# EAGLE design dots (EAGLE 6.1)
APVD: B.F (15-01-03); DOC_ID: CLK-SCH-06; DOC_PART_NO: CLK-PC-06; DOC_REV: A; DOC_TITLE: Display (model B) - Dots; PROJECT_NAME: Alarm Clock (Model B)
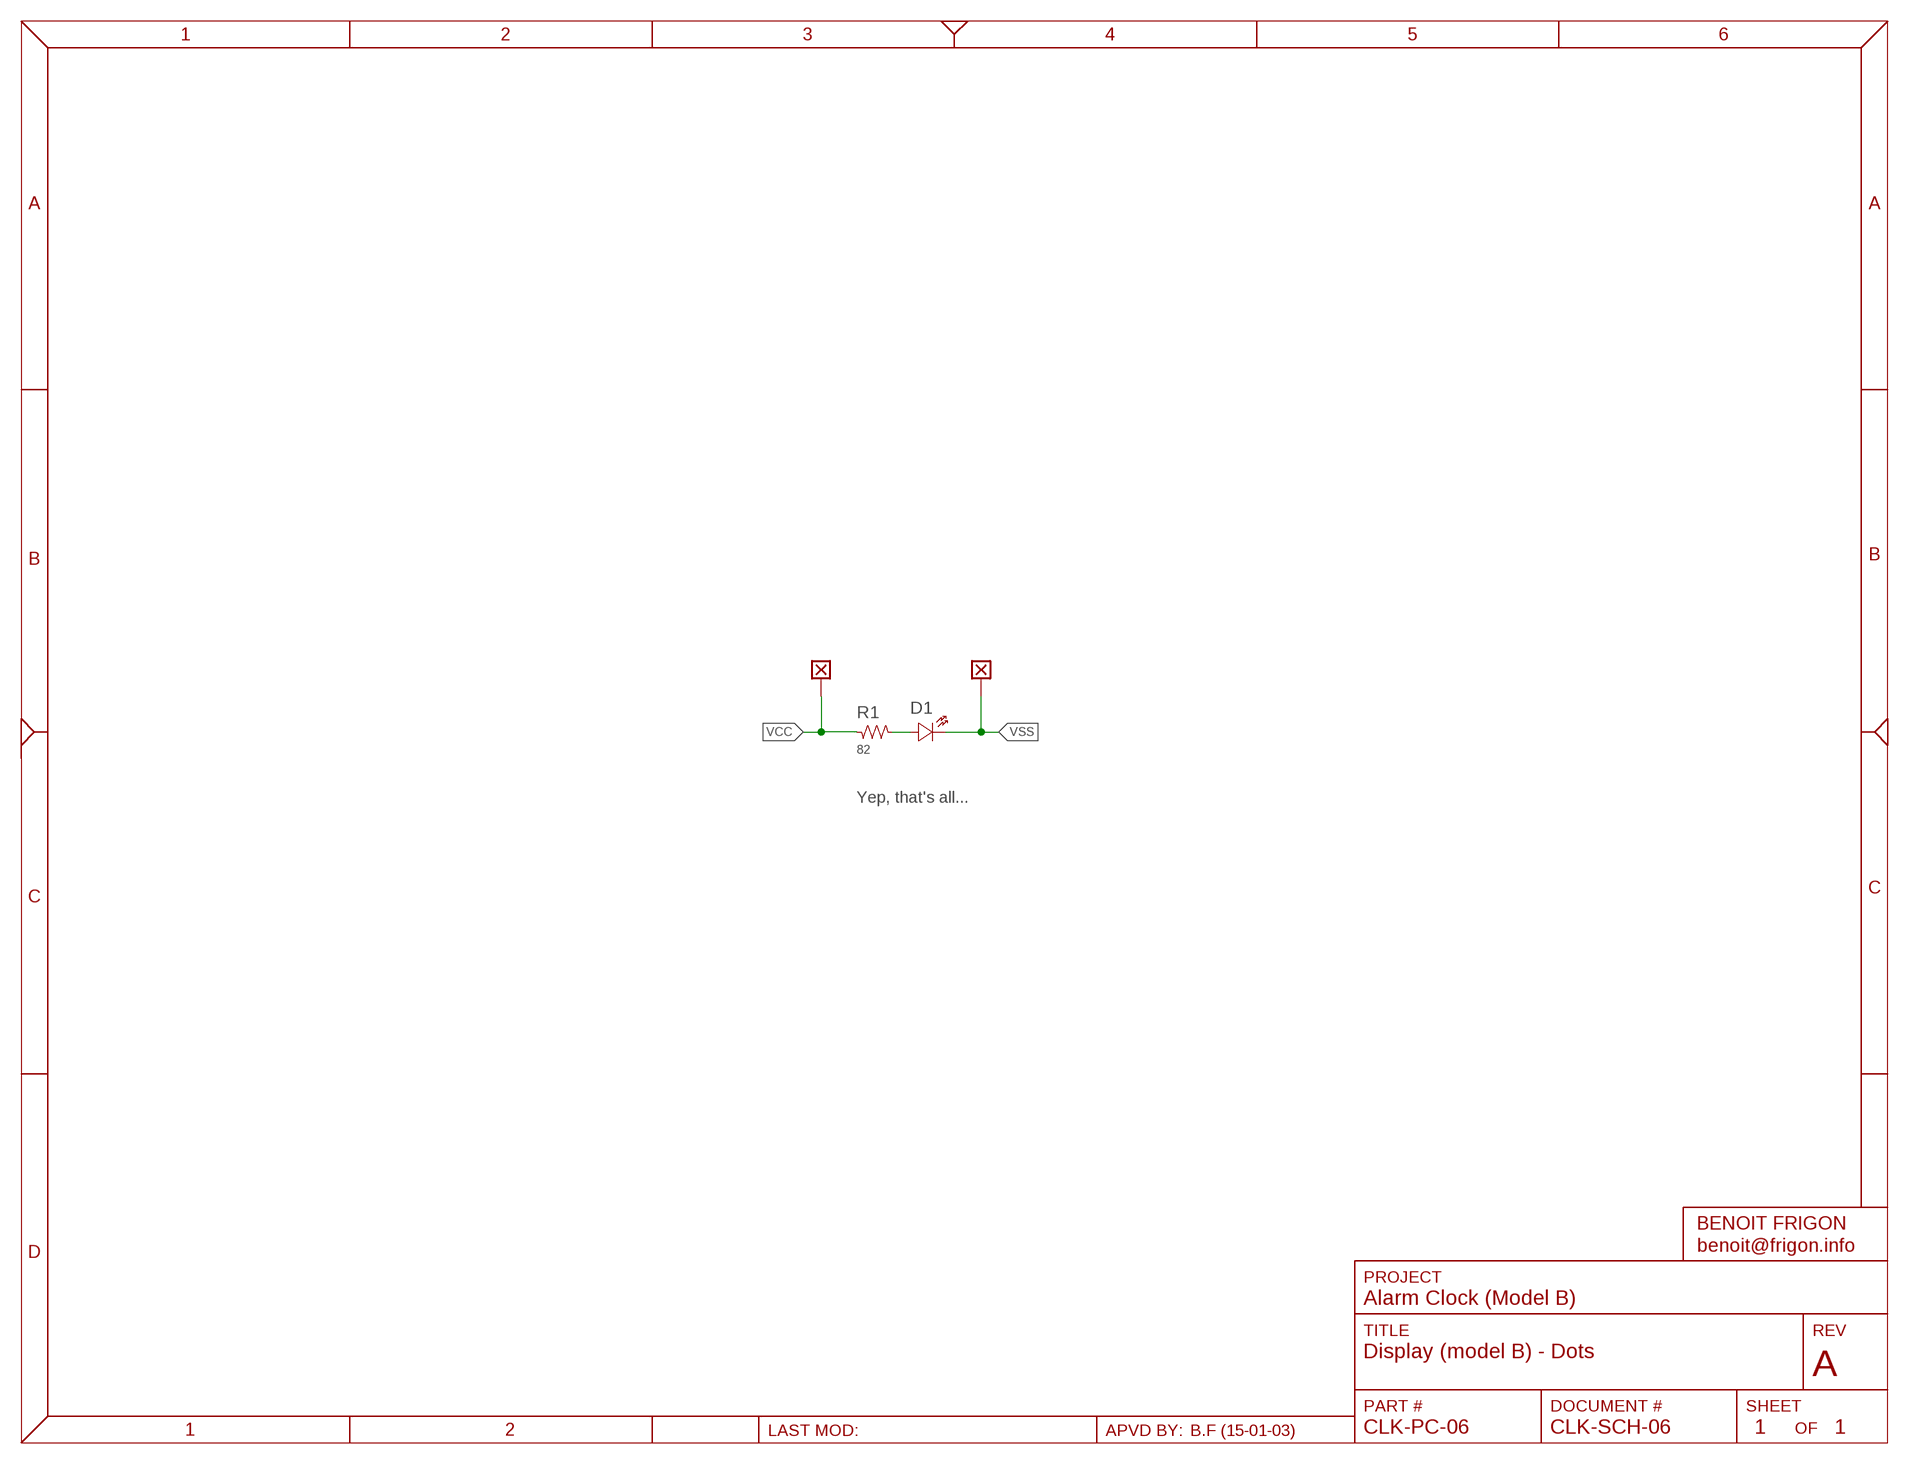
[diagram p0: schematic, sheet 1]

## Parts
D1  {ATTR:COLOR}  LED-0805  [CHIPLED_0805]
R1  82  RES-0603  [SMD_0603]
W1  WIRE  [WIRE_SMT]
W2  WIRE  [WIRE_SMT]

## Nets
N$2: D1.A R1.2
VCC: R1.1 W1.1
VSS: D1.K W2.1

## Notes on the sheet
- Yep, that's all...

## Library data of the parts
D1 = Optoelectronic:LED: Led; COLOR: Orange; DESCRIPTION: {DESCRIPTION} Chip 0805 - {ATTR:COLOR}; PACKAGE: SMT 0805; PART_NO: APT2012SECK/J4-PRV; SKU: -
R1 = Passive:RES: Resistor; DESCRIPTION: {DESCRIPTION} - SMT 0603 - {VALUE}; PACKAGE: SMT 0603
W1 W2 = Misc:WIRE; BOM: FALSE

## Board
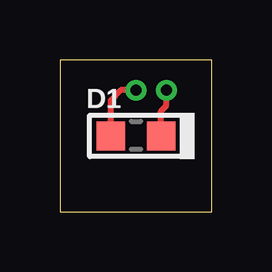
[diagram p1: board, top side]
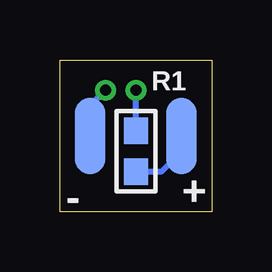
[diagram p2: board, bottom side, seen from below]

Size 6.35 x 6.35 mm. Coordinates in mm from the lower left corner, seen from the top.
Outline: 0,0 6.35,0 6.35,6.35 0,6.35 0,0
Copper layers (1*16): Top 0.035mm / dielectric 1.5mm / Bottom 0.035mm
Design rules: minimum track width 8mil, minimum drill 18mil, track to track 8mil, track to pad 8mil, pad to pad 8mil, via to via 8mil, smd to smd 8mil, copper to edge 16mil, drill to drill 8mil, minimum pad ring 10mil, minimum via ring 8mil, stop-mask expansion 4mil, vias tented up to drill 24mil, thermal gap 10mil

### Footprints (pad centres in the part's own frame; a part is rotated, then mirrored left to right if it is on the bottom)
CHIPLED_0805 = smd 1.2 x 1.2: A 0,-1.05; K 0,1.05
SMD_0603 = smd 1.1 x 1: 1 -0.85,0; 2 0.85,0
WIRE_SMT = smd 3.175 x 1.27: 1 0,0

### Placement (x,y rotation side)
D1  3.17,3.17 270 top
R1  3.17,2.54 90 bottom
W1  1.27,3.17 90 bottom
W2  5.08,3.17 90 bottom

### Tracks (layer width: path | path; a pad name or v marks a point on that pad's centre or on a via)
N$2  (via drill 0.46)
  Top 0.254: v3.17,5.08 2.54,5.08 2.12,4.67 D1.A
  Bottom 0.254: R1.2 v3.17,5.08
VCC
  Bottom 0.254: R1.1 2.12,1.69 1.27,2.54 W1.1
VSS  (via drill 0.46)
  Top 0.254: D1.K 4.22,4.22 4.45,4.45 v4.45,5.08
  Bottom 0.254: v4.45,5.08 5.08,4.45 W2.1

### Text on the board
bPlace: + | -
_tsilk: D1
_bsilk: R1 | + | -